# EAGLE schematic soth-core (EAGLE 7.2.0)
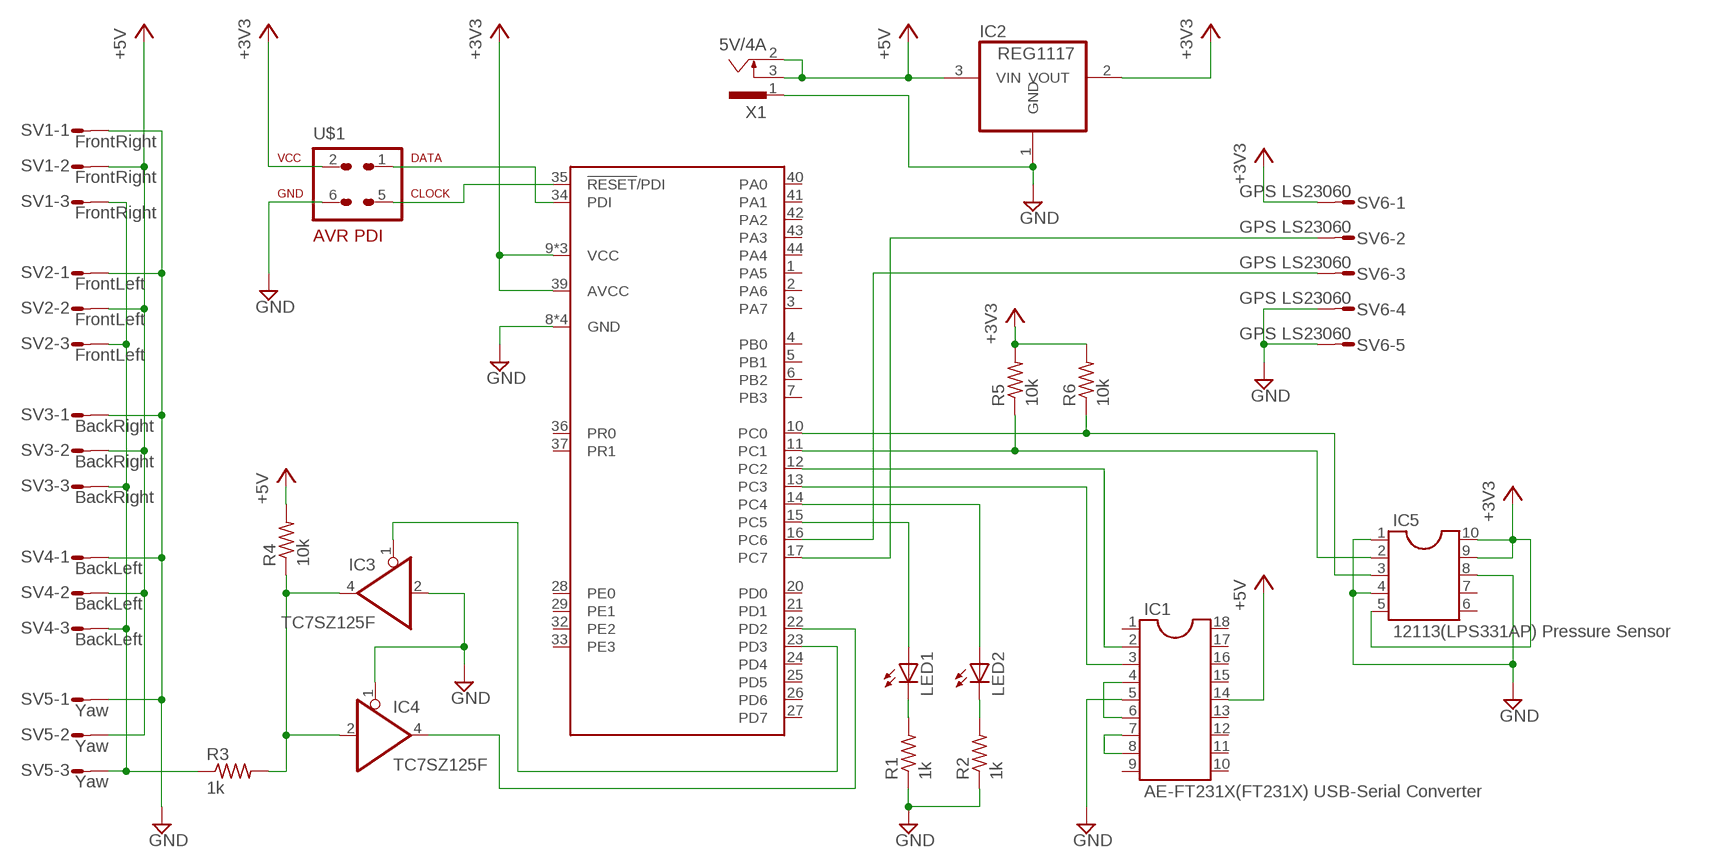
[diagram p0: schematic, sheet 1]

## Parts
IC1  AE-FT231X(FT231X) USB-Serial Converter  DIL18S  [SOCKET-18]
IC2  REG1117  [SOT223]
IC3  TC7SZ125F  74AHC1G125DBV  [SOT23-5]
IC4  TC7SZ125F  74AHC1G125DBV  [SOT23-5]
IC5  12113(LPS331AP) Pressure Sensor  DIL10  [DIL10]
LED1  LED  [SMARTLED-TTW]
LED2  LED  [SMARTLED-TTW]
R1  1k  R-US_R0805  [R0805]
R2  1k  R-US_R0805  [R0805]
R3  1k  R-US_R0805  [R0805]
R4  10k  R-US_R0805  [R0805]
R5  10k  R-US_R0805  [R0805]
R6  10k  R-US_R0805  [R0805]
SV1  FrontRight  S03P  [S03P]
SV2  FrontLeft  S03P  [S03P]
SV3  BackRight  S03P  [S03P]
SV4  BackLeft  S03P  [S03P]
SV5  Yaw  S03P  [S03P]
SV6  GPS LS23060  S05P  [S05P]
U1  ATXMEGA32D4-AU  [TQFP-44A-44]
U$1  AVR-PDIVERT  [AVR-ISP-6]
X1  5V/4A  733980-62  [733980-62]

## Nets
+3V3: IC2.2(VOUT) IC5.5 IC5.9 IC5.10 R5.2 R6.2 SV6.1 U1.9(VCC) U1.19(VCC) U1.31(VCC) U1.39(AVCC) U$1.2
+5V: IC1.14 IC2.3(VIN) R4.2 SV1.2 SV2.2 SV3.2 SV4.2 SV5.2 X1.2 X1.3
GND: IC1.5 IC2.1(GND) IC3.2(I) IC4.1(OE) IC5.1 IC5.4 IC5.8 R1.1 R2.1 SV1.1 SV2.1 SV3.1 SV4.1 SV5.1 SV6.4 SV6.5 U1.8(GND) U1.18(GND) U1.30(GND) U1.38(GND) U$1.6 X1.1
N$1: R3.1 SV1.3 SV2.3 SV3.3 SV4.3 SV5.3
N$2: LED1.A@1(A) U1.15(PC5)
N$3: LED2.A@1(A) U1.14(PC4)
N$4: LED1.C@1(C) R1.2
N$5: U1.35(!RESET!/PDI) U$1.5
N$6: U1.34(PDI) U$1.1
N$7: LED2.C@1(C) R2.2
N$8: IC4.4(O) U1.22(PD2)
N$9: SV6.2 U1.17(PC7)
N$10: IC1.2 U1.12(PC2)
N$11: IC1.3 U1.13(PC3)
N$12: IC1.7 IC1.8
N$13: IC1.4 IC1.6
N$14: SV6.3 U1.16(PC6)
N$15: IC3.1(OE) U1.23(PD3)
N$17: IC3.4(O) IC4.2(I) R3.2 R4.1
N$29: IC5.3 R6.1 U1.10(PC0)
N$32: IC5.2 R5.1 U1.11(PC1)
Unconnected: IC1.1 IC1.9 IC1.10 IC1.11 IC1.12 IC1.13 IC1.15 IC1.16 IC1.17 IC1.18 IC5.6 IC5.7 U1.1(PA5) U1.2(PA6) U1.3(PA7) U1.4(PB0) U1.5(PB1) U1.6(PB2) U1.7(PB3) U1.20(PD0) U1.21(PD1) U1.24(PD4) U1.25(PD5) U1.26(PD6) U1.27(PD7) U1.28(PE0) U1.29(PE1) U1.32(PE2) U1.33(PE3) U1.36(PR0) U1.37(PR1) U1.40(PA0) U1.41(PA1) U1.42(PA2) U1.43(PA3) U1.44(PA4)

## Power pins joined to a net without a drawn wire
GND: IC3.3(GND) IC4.3(GND)
VCC: IC3.5(VCC) IC4.5(VCC)

## Library data of the parts
IC1 = ic-package:DIL18: Dual In Line / Socket
IC2 = burr-brown:REG1117: 800mA and 1A Low Dropout (LDO) Positive Regulator 1.8V, 2.5V, 2.85V, 3.3V, 5V, and Adj; MPN: REG1117; OC_FARNELL: 1097566; OC_NEWARK: 14P6981
IC3 IC4 = 74xx-little-de:74*1G125: Single Bus Buffer Gate with 3-State Output
IC5 = ic-package:DIL10: Dual In Line / Socket
LED1 LED2 = led:LED: LED OSRAM: - CHIPLED LG R971, LG N971, LY N971, LG Q971, LY Q971, LO R971, LY R971 LH N974, LH R974 LS Q976, LO Q976, LY Q976 LO Q996 - Hyper CHIPLED LW Q18S LB Q993, LB Q99A, LB R99A - SideLED LS A670, LO A670, LY A670, LG A670, LP A670 LB A673, LV A673, LT A673, LW A673 LH A674 LY A675 LS A676, LA A676, LO A676, LY A676, LW A676 LS A679, LY A679, LG A679 - Hyper Micro SIDELED® LS Y876, LA Y876, LO Y876, LY Y876 LT Y87S - SmartLED LW L88C, LW L88S LB L89C, LB L89S, LG L890 LS L89K, LO L89K, LY L89K LS L896, LA L896, LO L896, LY L896 - TOPLED LS T670, LO T670, LY T670, LG T670, LP T670 LSG T670, LSP T670, LSY T670, LOP T670, LYG T670 LG T671, LOG T671, LSG T671 LB T673, LV T673, LT T673, LW T673 LH T674 LS T676, LA T676, LO T676, LY T676, LB T676, LH T676, LSB T676, LW T676 LB T67C, LV T67C, LT T67C, LS T67K, LO T67K, LY T67K, LW E67C LS E67B, LA E67B, LO E67B, LY E67B, LB E67C, LV E67C, LT E67C LW T67C LS T679, LY T679, LG T679 LS T770, LO T770, LY T770, LG T770, LP T770 LB T773, LV T773, LT T773, LW T773 LH T774 LS E675, LA E675, LY E675, LS T675 LS T776, LA T776, LO T776, LY T776, LB T776 LHGB T686 LT T68C, LB T68C - Hyper Mini TOPLED® LB M676 - Mini TOPLED Santana® LG M470 LS M47K, LO M47K, LY M47K Source: http://www.osram.convergy.de LUXEON: - LUMILED® LXK2-PW12-R00, LXK2-PW12-S00, LXK2-PW14-U00, LXK2-PW14-V00 LXK2-PM12-R00, LXK2-PM12-S00, LXK2-PM14-U00 LXK2-PE12-Q00, LXK2-PE12-R00, LXK2-PE12-S00, LXK2-PE14-T00, LXK2-PE14-U00 LXK2-PB12-K00, LXK2-PB12-L00, LXK2-PB12-M00, LXK2-PB14-N00, LXK2-PB14-P00, LXK2-PB14-Q00 LXK2-PR12-L00, LXK2-PR12-M00, LXK2-PR14-Q00, LXK2-PR14-R00 LXK2-PD12-Q00, LXK2-PD12-R00, LXK2-PD12-S00 LXK2-PH12-R00, LXK2-PH12-S00 LXK2-PL12-P00, LXK2-PL12-Q00, LXK2-PL12-R00 Source: www.luxeon.com KINGBRIGHT: KA-3528ASYC Source: www.kingbright.com
R1-R6 = rcl:R-US_: RESISTOR, American symbol
SV1-SV5 = con-amp-mt:S03P: AMP MT CONNECTOR; OC_FARNELL: unknown; OC_NEWARK: unknown
SV6 = con-amp-mt:S05P: AMP MT CONNECTOR; OC_FARNELL: unknown; OC_NEWARK: unknown
U1 = atmega-atxmega:ATXMEGA32D4: 8/16-bit XMEGA C4 Microcontroller Features High-performance, Low-power 8/16-bit Atmel® AVR® XMEGA® Microcontroller Non-volatile Program and Data Memories – 16 KB - 128 KB of In-System Self-Programmable Flash – 4 KB - 8 KB Boot Code Section with Independent Lock Bits – 1 KB - 2 KB EEPROM – 2 KB - 8 KB Internal SRAM Peripheral Features – Four-channel Event System – Four 16-bit Timer/Counters Three Timer/Counters with 4 Output Compare or Input Capture channels One Timer/Counter with 2 Output Compare or Input Capture channels High-Resolution Extensions on two Timer/Counters Advanced Waveform Extension on one Timer/Counter – Two USARTs IrDA Extension on one USART – Two Two-Wire Interfaces with dual address match (I2C and SMBus compatible) – Two SPIs (Serial Peripheral Interfaces) peripherals – 16-bit Real Time Counter with Separate Oscillator – One Twelve-channel, 12-bit, 200 ksps Analog to Digital Converter – Two Analog Comparators with Window compare function – External Interrupts on all General Purpose I/O pins – Programmable Watchdog Timer with Separate On-chip Ultra Low Power Oscillator Special Microcontroller Features – Power-on Reset and Programmable Brown-out Detection – Internal and External Clock Options with PLL – Programmable Multi-level Interrupt Controller – Sleep Modes: Idle, Power-down, Standby, Power-save, Extended Standby – Advanced Programming, Test and Debugging Interface PDI (Program and Debug Interface) for programming, test and debugging I/O and Packages – 34 Programmable I/O Lines – 44-lead TQFP – 44-pad VQFN/QFN – 49-ball VFBGA Operating Voltage – 1.6 – 3.6V Speed performance – 0 – 12 MHz @ 1.6 – 3.6V – 0 – 32 MHz @ 2.7 – 3.6V
U$1 = atmega-atxmega:AVR-PDI: AVR PDI programming interface connector
X1 = con-conrad:73398?: FEMALE PRINT CONNECTOR Niedervolt-Steckverbinder Distributor Conrad